# EAGLE design lichtenstein_pwm (EAGLE 9.0.1)

## Sheet 1 of 2: Omega2 socket, power supplies
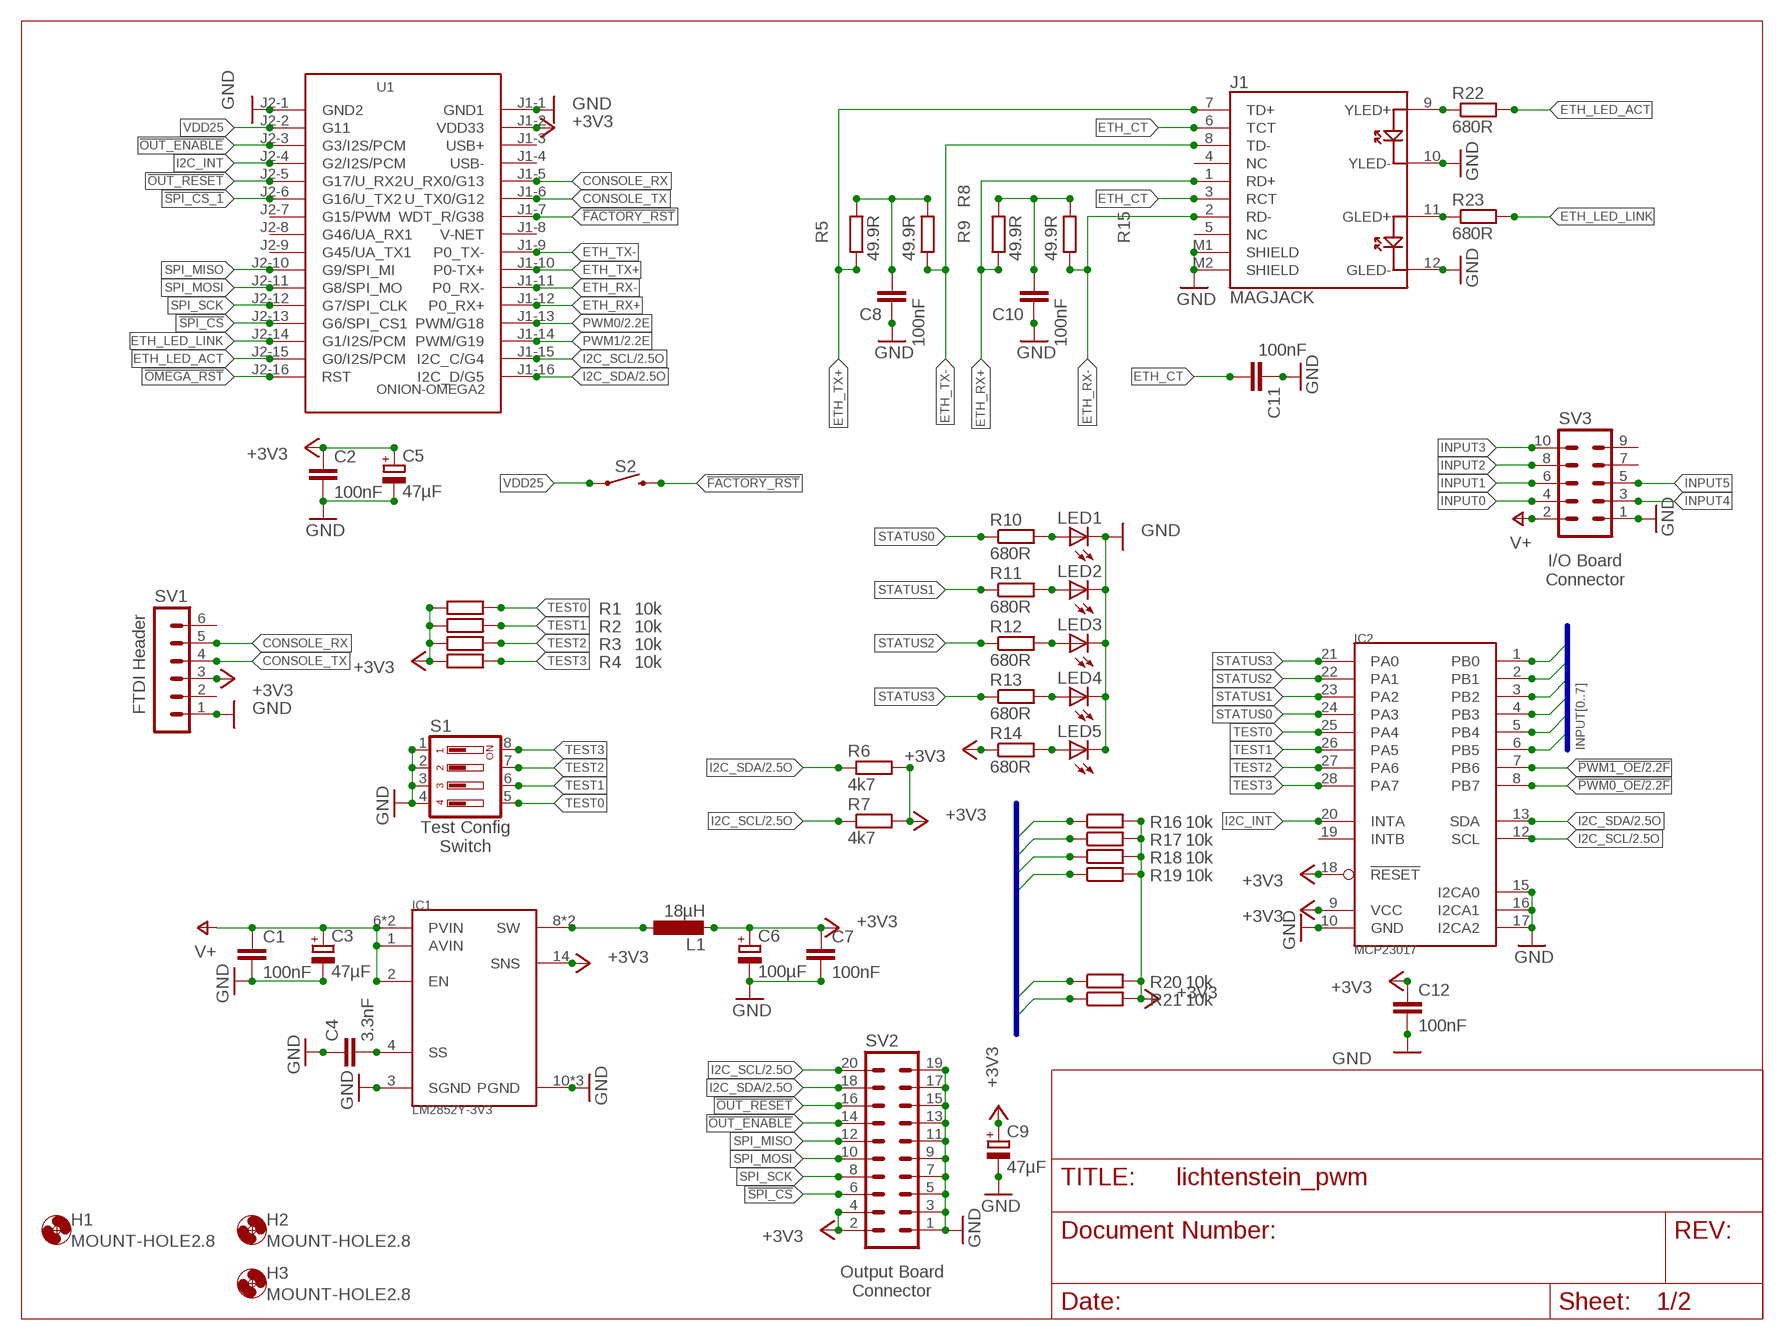
[diagram p0: schematic, sheet 1]

### Parts
C1  100nF  C-EUC0805  [C0805]
C2  100nF  C-EUC0805  [C0805]
C3  47µF  CPOL-EUCT7343  [CT7343]
C4  3.3nF  C-EUC0805  [C0805]
C5  47µF  CPOL-EUCT7343  [CT7343]
C6  100µF  CPOL-EUCT7343  [CT7343]
C7  100nF  C-EUC0805  [C0805]
C8  100nF  C-EUC0805  [C0805]
C9  47µF  CPOL-EUSMCD  [SMC_D]
C10  100nF  C-EUC0805  [C0805]
C11  100nF  C-EUC0805  [C0805]
C12  100nF  C-EUC0805  [C0805]
H1  MOUNT-HOLE2.8  [2,8]
H2  MOUNT-HOLE2.8  [2,8]
H3  MOUNT-HOLE2.8  [2,8]
IC1  LM2852Y-3V3  LM2852HTSSOP14  [HTSSOP14]
IC2  MCP23017  MCP23017SSOP28  [SSOP28]
J1  MAGJACK  [MAGJACK]
L1  18µH  SRR1050A  [SRR1050A]
LED1  LEDCHIPLED_1206  [CHIPLED_1206]
LED2  LEDCHIPLED_1206  [CHIPLED_1206]
LED3  LEDCHIPLED_1206  [CHIPLED_1206]
LED4  LEDCHIPLED_1206  [CHIPLED_1206]
LED5  LEDCHIPLED_1206  [CHIPLED_1206]
R1  10k  R-EU_M0805  [M0805]
R2  10k  R-EU_M0805  [M0805]
R3  10k  R-EU_M0805  [M0805]
R4  10k  R-EU_M0805  [M0805]
R5  49.9R  R-EU_M0805  [M0805]
R6  4k7  R-EU_M0805  [M0805]
R7  4k7  R-EU_M0805  [M0805]
R8  49.9R  R-EU_M0805  [M0805]
R9  49.9R  R-EU_M0805  [M0805]
R10  680R  R-EU_M0805  [M0805]
R11  680R  R-EU_M0805  [M0805]
R12  680R  R-EU_M0805  [M0805]
R13  680R  R-EU_M0805  [M0805]
R14  680R  R-EU_M0805  [M0805]
R15  49.9R  R-EU_M0805  [M0805]
R16  10k  R-EU_M0805  [M0805]
R17  10k  R-EU_M0805  [M0805]
R18  10k  R-EU_M0805  [M0805]
R19  10k  R-EU_M0805  [M0805]
R20  10k  R-EU_M0805  [M0805]
R21  10k  R-EU_M0805  [M0805]
R22  680R  R-EU_M0805  [M0805]
R23  680R  R-EU_M0805  [M0805]
S1  219-04  [CTS-219-04]
S2  MOMENTARY-SWITCH-SPST-PTH-6.0MM  [TACTILE_SWITCH_PTH_6.0MM]
SV1  MA06-1  [MA06-1]
SV2  MA10-2  [MA10-2]
SV3  MA05-2  [MA05-2]
U1  ONION-OMEGA2  [ONION-2MM-2X16]

### Nets
!FACTORY_RST: S2.3 U1.J1-7(WDT_R/G38)
!OMEGA_RST: U1.J2-16(RST)
!OUT_ENABLE: SV2.14 U1.J2-3(G3/I2S/PCM)
!OUT_RESET: SV2.16 U1.J2-5(G17/U_RX2)
!PWM0_OE: IC2.8(PB7) ; also sheet 2
!PWM1_OE: IC2.7(PB6) ; also sheet 2
!SPI_CS: SV2.6 U1.J2-13(G6/SPI_CS1)
!SPI_CS_1: U1.J2-6(G16/U_TX2)
+3V3: C2.1 C5.+ C6.+ C7.1 C9.+ C12.1 IC1.14(SNS) IC2.9(VCC) IC2.18(!RESET) L1.P$2 R1.1 R2.1 R3.1 R4.1 R6.2 R7.2 R14.1 R16.2 R17.2 R18.2 R19.2 R20.2 R21.2 SV1.3 SV2.2 SV2.4 U1.J1-2(VDD33) ; also sheet 2
CONSOLE_RX: SV1.5 U1.J1-5(U_RX0/G13)
CONSOLE_TX: SV1.4 U1.J1-6(U_TX0/G12)
ETH_CT: C11.2 J1.3(RCT) J1.6(TCT)
ETH_LED_ACT: R22.2 U1.J2-15(G0/I2S/PCM)
ETH_LED_LINK: R23.2 U1.J2-14(G1/I2S/PCM)
ETH_RX+: J1.1(RD+) R9.1 U1.J1-12(P0_RX+)
ETH_RX-: J1.2(RD-) R15.1 U1.J1-11(P0_RX-)
ETH_TX+: J1.7(TD+) R5.1 U1.J1-10(P0-TX+)
ETH_TX-: J1.8(TD-) R8.1 U1.J1-9(P0_TX-)
GND: C1.2 C2.2 C3.- C4.1 C5.- C6.- C7.2 C8.1 C9.- C10.1 C11.1 C12.2 IC1.3(SGND) IC1.10(PGND) IC1.11(PGND) IC1.PAD(PGND) IC2.10(GND) IC2.15(I2CA0) IC2.16(I2CA1) IC2.17(I2CA2) J1.10(YLED-) J1.12(GLED-) J1.M1(SHIELD) J1.M2(SHIELD) LED1.C LED2.C LED3.C LED4.C LED5.C S1.1 S1.2 S1.3 S1.4 SV1.1 SV2.1 SV2.3 SV2.5 SV2.7 SV2.9 SV2.11 SV2.13 SV2.15 SV2.17 SV2.19 SV3.1 U1.J1-1(GND1) U1.J2-1(GND2) ; also sheet 2
I2C_INT: IC2.20(INTA) U1.J2-4(G2/I2S/PCM)
I2C_SCL: IC2.12(SCL) R7.1 SV2.20 U1.J1-15(I2C_C/G4) ; also sheet 2
I2C_SDA: IC2.13(SDA) R6.1 SV2.18 U1.J1-16(I2C_D/G5) ; also sheet 2
INPUT0: IC2.2(PB1) R16.1 SV3.4
INPUT1: IC2.4(PB3) R17.1 SV3.6
INPUT2: IC2.6(PB5) R20.1 SV3.8
INPUT3: IC2.5(PB4) R21.1 SV3.10
INPUT4: IC2.1(PB0) R18.1 SV3.3
INPUT5: IC2.3(PB2) R19.1 SV3.5
N$1: LED5.A R14.2
N$2: LED1.A R10.2
N$3: C8.2 R5.2 R8.2
N$4: J1.9(YLED+) R22.1
N$5: J1.11(GLED+) R23.1
N$6: C10.2 R9.2 R15.2
N$7: IC1.8(SW) IC1.9(SW) L1.P$1
N$8: C4.2 IC1.4(SS)
N$9: LED2.A R11.2
N$10: LED3.A R12.2
N$11: LED4.A R13.2
PWM0: U1.J1-13(PWM/G18) ; also sheet 2
PWM1: U1.J1-14(PWM/G19) ; also sheet 2
SPI_MISO: SV2.12 U1.J2-10(G9/SPI_MI)
SPI_MOSI: SV2.10 U1.J2-11(G8/SPI_MO)
SPI_SCK: SV2.8 U1.J2-12(G7/SPI_CLK)
STATUS0: IC2.24(PA3) R10.1
STATUS1: IC2.23(PA2) R11.1
STATUS2: IC2.22(PA1) R12.1
STATUS3: IC2.21(PA0) R13.1
TEST0: IC2.25(PA4) R1.2 S1.5
TEST1: IC2.26(PA5) R2.2 S1.6
TEST2: IC2.27(PA6) R3.2 S1.7
TEST3: IC2.28(PA7) R4.2 S1.8
V+: C1.1 C3.+ IC1.1(AVIN) IC1.2(EN) IC1.6(PVIN) IC1.7(PVIN) SV3.2 ; also sheet 2
VDD25: S2.1 U1.J2-2(G11)
Unconnected: IC2.19(INTB) J1.4(NC) J1.5(NC) SV1.2 SV1.6 SV3.7 SV3.9 U1.J1-3(USB+) U1.J1-4(USB-) U1.J1-8(V-NET) U1.J2-7(G15/PWM) U1.J2-8(G46/UA_RX1) U1.J2-9(G45/UA_TX1)

### Buses
INPUT[0..7]

### Notes on the sheet
- I/O Board
  Connector
- FTDI Header
- Test Config
  Switch
- Output Board
  Connector

## Sheet 2 of 2: Outputs
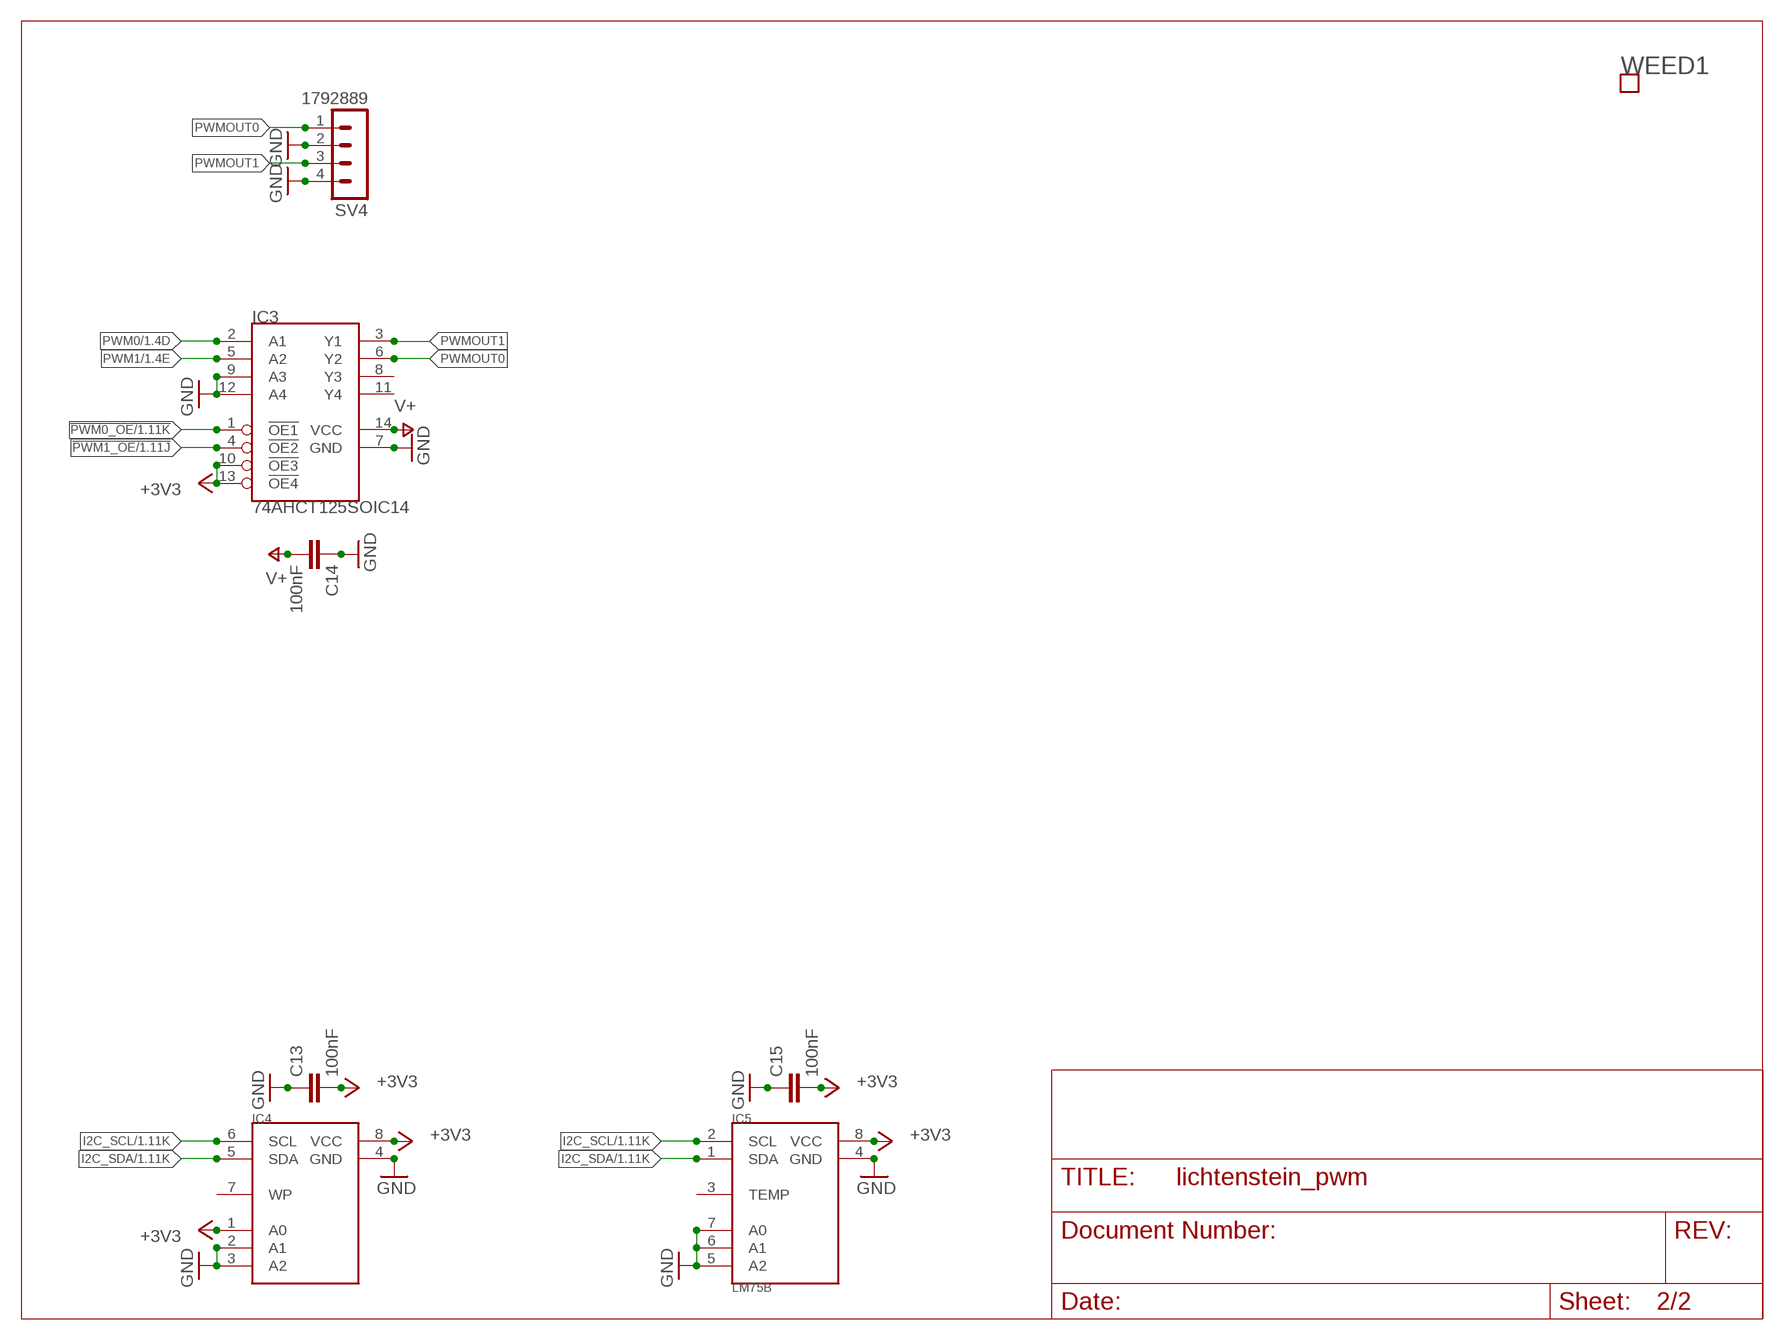
[diagram p1: schematic, sheet 2]

### Parts
C13  100nF  C-EUC0805  [C0805]
C14  100nF  C-EUC0805  [C0805]
C15  100nF  C-EUC0805  [C0805]
IC3  74AHCT125SOIC14  [SO14]
IC4  AT24C02DSOIC-8  [SOIC8]
IC5  LM75B  [SOIC8]
SV4  1792889  [1792889]
WEED1  WEED  [DOINK]

### Nets
!PWM0_OE: IC3.1(!OE1) ; also sheet 1
!PWM1_OE: IC3.4(!OE2) ; also sheet 1
+3V3: C13.2 C15.2 IC3.10(!OE3) IC3.13(!OE4) IC4.1(A0) IC4.8(VCC) IC5.8(VCC) ; also sheet 1
GND: C13.1 C14.1 C15.1 IC3.7(GND) IC3.9(A3) IC3.12(A4) IC4.2(A1) IC4.3(A2) IC4.4(GND) IC5.5(A2) IC5.6(A1) IC5.7(A0) SV4.2 SV4.4 ; also sheet 1
I2C_SCL: IC4.6(SCL) IC5.2(SCL) ; also sheet 1
I2C_SDA: IC4.5(SDA) IC5.1(SDA) ; also sheet 1
PWM0: IC3.2(A1) ; also sheet 1
PWM1: IC3.5(A2) ; also sheet 1
PWMOUT0: IC3.6(Y2) SV4.1
PWMOUT1: IC3.3(Y1) SV4.3
V+: C14.2 IC3.14(VCC) ; also sheet 1
Unconnected: IC3.8(Y3) IC3.11(Y4) IC4.7(WP) IC5.3(TEMP)

## Power pins joined to a net without a drawn wire
GND: IC5.4(GND)

## Library data of the parts
C1 C2 C7 C8 C10-C15 = rcl:C-EU: CAPACITOR, European symbol; MOUSER: 710-885012207072; SPICEPREFIX: C
C3 C5 C9 = rcl:CPOL-EU: POLARIZED CAPACITOR, European symbol; MOUSER: 581-TAJD476M016RNJV; SPICEPREFIX: C
C4 = rcl:C-EU: CAPACITOR, European symbol; MOUSER: 710-885012207089; SPICEPREFIX: C
C6 = rcl:CPOL-EU: POLARIZED CAPACITOR, European symbol; MOUSER: 581-NOSD107M006; SPICEPREFIX: C
H1-H3 = holes:MOUNT-HOLE: MOUNTING HOLE with drill center marker
IC1 = lichtenstein_onion:LM2852: 2A 500/1500kHz Synchronous Buck Regulator Information <http://www.ti.com/product/lm2852/description>; MOUSER: 926-LM2852YMXA33NOPB
IC2 = lichtenstein_onion:MCP23017; MOUSER: 579-MCP23017T-E/SS
IC3 = lichtenstein_onion:74AHCT125: UADRUPLE BUS BUFFER GATES WITH 3-STATE OUTPUTS Datasheet <http://www.ti.com/lit/ds/symlink/sn74ahct125.pdf>; MOUSER: 595-SN74AHCT125D
IC4 = lichtenstein_onion:AT24C02D: I2C-Compatible (2-wire) Serial EEPROM; 1-Kbit (128 x 8) or 2-Kbit (256 x 8) Datasheet <http://ww1.microchip.com/downloads/en/DeviceDoc/Atmel-8871F-SEEPROM-AT24C01D-02D-Datasheet.pdf>; MOUSER: 556-AT24C02D-SSHM-T
IC5 = lichtenstein_onion:LM75B: Digital temperature sensor and thermal watchdog Datasheet <https://www.mouser.com/datasheet/2/302/LM75B-1126491.pdf>; MOUSER: 771-LM75BD118
J1 = SparkFun-Connectors:MAGJACK: MAGJACK: RJ-45 with LEDs This is a single port, RJ45 ethernet jacks with built in transformer (magnetics), status LEDs, and shielding. Here is the connector we sell at SparkFun: RJ45 Ethernet MagJack-Compatible <https://www.sparkfun.com/products/8534> (PRT-08534) Datasheet <http://www.sparkfun.com/datasheets/Prototyping/MagJack.pdf> It is used on this SparkFun product: SparkFun RJ45 MagJack Breakout <https://www.sparkfun.com/products/13021> (BOB-13021); PROD_ID: CONN-09556; SF_ID: PRT-08534
L1 = lichtenstein_onion:SRR1050A: SRR1050A Series - Shielded Power Inductors Datasheet <https://www.mouser.com/datasheet/2/54/rr1050a-964771.pdf>; MOUSER: 652-SRR1050A-180Y
LED1 = led:LED: LED OSRAM: - CHIPLED LG R971, LG N971, LY N971, LG Q971, LY Q971, LO R971, LY R971 LH N974, LH R974 LS Q976, LO Q976, LY Q976 LO Q996 - Hyper CHIPLED LW Q18S LB Q993, LB Q99A, LB R99A - SideLED LS A670, LO A670, LY A670, LG A670, LP A670 LB A673, LV A673, LT A673, LW A673 LH A674 LY A675 LS A676, LA A676, LO A676, LY A676, LW A676 LS A679, LY A679, LG A679 - Hyper Micro SIDELED® LS Y876, LA Y876, LO Y876, LY Y876 LT Y87S - SmartLED LW L88C, LW L88S LB L89C, LB L89S, LG L890 LS L89K, LO L89K, LY L89K LS L896, LA L896, LO L896, LY L896 - TOPLED LS T670, LO T670, LY T670, LG T670, LP T670 LSG T670, LSP T670, LSY T670, LOP T670, LYG T670 LG T671, LOG T671, LSG T671 LB T673, LV T673, LT T673, LW T673 LH T674 LS T676, LA T676, LO T676, LY T676, LB T676, LH T676, LSB T676, LW T676 LB T67C, LV T67C, LT T67C, LS T67K, LO T67K, LY T67K, LW E67C LS E67B, LA E67B, LO E67B, LY E67B, LB E67C, LV E67C, LT E67C LW T67C LS T679, LY T679, LG T679 LS T770, LO T770, LY T770, LG T770, LP T770 LB T773, LV T773, LT T773, LW T773 LH T774 LS E675, LA E675, LY E675, LS T675 LS T776, LA T776, LO T776, LY T776, LB T776 LHGB T686 LT T68C, LB T68C - Hyper Mini TOPLED® LB M676 - Mini TOPLED Santana® LG M470 LS M47K, LO M47K, LY M47K Source: http://www.osram.convergy.de LUXEON: - LUMILED® LXK2-PW12-R00, LXK2-PW12-S00, LXK2-PW14-U00, LXK2-PW14-V00 LXK2-PM12-R00, LXK2-PM12-S00, LXK2-PM14-U00 LXK2-PE12-Q00, LXK2-PE12-R00, LXK2-PE12-S00, LXK2-PE14-T00, LXK2-PE14-U00 LXK2-PB12-K00, LXK2-PB12-L00, LXK2-PB12-M00, LXK2-PB14-N00, LXK2-PB14-P00, LXK2-PB14-Q00 LXK2-PR12-L00, LXK2-PR12-M00, LXK2-PR14-Q00, LXK2-PR14-R00 LXK2-PD12-Q00, LXK2-PD12-R00, LXK2-PD12-S00 LXK2-PH12-R00, LXK2-PH12-S00 LXK2-PL12-P00, LXK2-PL12-Q00, LXK2-PL12-R00 Source: www.luxeon.com KINGBRIGHT: KA-3528ASYC Source: www.kingbright.com; MOUSER: 604-APTR3216SRCPRV
LED2-LED5 = led:LED: LED OSRAM: - CHIPLED LG R971, LG N971, LY N971, LG Q971, LY Q971, LO R971, LY R971 LH N974, LH R974 LS Q976, LO Q976, LY Q976 LO Q996 - Hyper CHIPLED LW Q18S LB Q993, LB Q99A, LB R99A - SideLED LS A670, LO A670, LY A670, LG A670, LP A670 LB A673, LV A673, LT A673, LW A673 LH A674 LY A675 LS A676, LA A676, LO A676, LY A676, LW A676 LS A679, LY A679, LG A679 - Hyper Micro SIDELED® LS Y876, LA Y876, LO Y876, LY Y876 LT Y87S - SmartLED LW L88C, LW L88S LB L89C, LB L89S, LG L890 LS L89K, LO L89K, LY L89K LS L896, LA L896, LO L896, LY L896 - TOPLED LS T670, LO T670, LY T670, LG T670, LP T670 LSG T670, LSP T670, LSY T670, LOP T670, LYG T670 LG T671, LOG T671, LSG T671 LB T673, LV T673, LT T673, LW T673 LH T674 LS T676, LA T676, LO T676, LY T676, LB T676, LH T676, LSB T676, LW T676 LB T67C, LV T67C, LT T67C, LS T67K, LO T67K, LY T67K, LW E67C LS E67B, LA E67B, LO E67B, LY E67B, LB E67C, LV E67C, LT E67C LW T67C LS T679, LY T679, LG T679 LS T770, LO T770, LY T770, LG T770, LP T770 LB T773, LV T773, LT T773, LW T773 LH T774 LS E675, LA E675, LY E675, LS T675 LS T776, LA T776, LO T776, LY T776, LB T776 LHGB T686 LT T68C, LB T68C - Hyper Mini TOPLED® LB M676 - Mini TOPLED Santana® LG M470 LS M47K, LO M47K, LY M47K Source: http://www.osram.convergy.de LUXEON: - LUMILED® LXK2-PW12-R00, LXK2-PW12-S00, LXK2-PW14-U00, LXK2-PW14-V00 LXK2-PM12-R00, LXK2-PM12-S00, LXK2-PM14-U00 LXK2-PE12-Q00, LXK2-PE12-R00, LXK2-PE12-S00, LXK2-PE14-T00, LXK2-PE14-U00 LXK2-PB12-K00, LXK2-PB12-L00, LXK2-PB12-M00, LXK2-PB14-N00, LXK2-PB14-P00, LXK2-PB14-Q00 LXK2-PR12-L00, LXK2-PR12-M00, LXK2-PR14-Q00, LXK2-PR14-R00 LXK2-PD12-Q00, LXK2-PD12-R00, LXK2-PD12-S00 LXK2-PH12-R00, LXK2-PH12-S00 LXK2-PL12-P00, LXK2-PL12-Q00, LXK2-PL12-R00 Source: www.luxeon.com KINGBRIGHT: KA-3528ASYC Source: www.kingbright.com; MOUSER: 604-APTR3216SGC
R1-R4 R16-R21 = rcl:R-EU_: RESISTOR, European symbol; MOUSER: 652-CR0805FX-1002ELF; SPICEPREFIX: R
R5 R9 R15 = rcl:R-EU_: RESISTOR, European symbol; MOUSER: 652-CR0805FX-49R9ELF; SPICEPREFIX: R
R6-R8 = rcl:R-EU_: RESISTOR, European symbol; MOUSER: 652-CR0805-FX4701GLF; SPICEPREFIX: R
R10-R14 R22 R23 = rcl:R-EU_: RESISTOR, European symbol; MOUSER: 652-CR0805-FX6800GLF; SPICEPREFIX: R
S1 = switch-dil:219-04*: Surface Mount DIP Switch Series 219 SMT CTS Electronic Components Sourc: www.ctscorp.com; MOUSER: 774-219-4LPS; OC_FARNELL: unknown; OC_NEWARK: unknown
S2 = SparkFun-Switches:MOMENTARY-SWITCH-SPST: Momentary Switch (Pushbutton) - SPST Normally-open (NO) SPST momentary switches (buttons, pushbuttons). Variants PTH-12MM - 12mm square, through-hole Momentary Pushbutton Switch - 12mm Square <https://www.sparkfun.com/products/9190> (COM-09190) PTH-6.0MM, PTH-6.0MM-KIT - 6.0mm square, through-hole Mini Pushbutton Switch <https://www.sparkfun.com/products/97> (COM-00097) KIT package intended for soldering kit's - only one side of pads' copper is exposed. PTH-RIGHT-ANGLE-KIT - Right-angle, through-hole Right Angle Tactile Button <https://www.sparkfun.com/products/10791> - Used on SparkFun BigTime Watch Kit <https://www.sparkfun.com/products/11734> SMD-12MM - 12mm square, surface-mount Tactile Button - SMD (12mm) <https://www.sparkfun.com/products/12993> (COM-12993) Used on SparkFun PicoBoard <https://www.sparkfun.com/products/11888> SMD-4.5MM - 4.5mm Square Trackball Switch Used on SparkFun Blackberry Trackballer Breakout <https://www.sparkfun.com/products/13169> SMD-4.6MMX2.8MM - 4.60mm x 2.80mm, surface mount Used on SparkFun SAMD21 Mini Breakout <https://www.sparkfun.com/products/13664> SMD-5.2MM, SMD-5.2-REDUNDANT - 5.2mm square, surface-mount Mini Pushbutton Switch - SMD <https://www.sparkfun.com/products/8720> (COM-08720) Used on Arduino Pro Mini <https://www.sparkfun.com/products/11114> REDUNDANT package connects both switch circuits together SMD-6.0X3.5MM - 6.0 x 3.5mm, surface mount Momentary Reset Switch SMD <https://www.sparkfun.com/products/8229> (COM-08229) SMD-6.2MM-TALL - 6.2mm square, surface mount Tactile Button - SMD (6mm) <https://www.sparkfun.com/products/12992> Used on SparkFun Digital Sandbox <https://www.sparkfun.com/products/12651> SMD-RIGHT-ANGLE - Right-angle, surface mount Used on SparkFun Block for Intel® Edison - Arduino <https://www.sparkfun.com/products/13036>; MOUSER: 612-TL1105B; PROD_ID: SWCH-08441; SF_SKU: COM-00097
SV1 = con-lstb:MA06-1: PIN HEADER; OC_FARNELL: unknown; OC_NEWARK: unknown
SV2 = con-lstb:MA10-2: PIN HEADER; MOUSER: 517-30320-6002; OC_FARNELL: unknown; OC_NEWARK: unknown
SV3 = con-lstb:MA05-2: PIN HEADER; MOUSER: 517-30310-6002; OC_FARNELL: unknown; OC_NEWARK: unknown
SV4 = lichtenstein_onion:1792889; MOUSER: 651-1792889
U1 = lichtenstein_onion:ONION-OMEGA2: Onion Omega; MOUSER: 353-OM-O2P
WEED1 = lichtenstein_onion:WEED

## Board
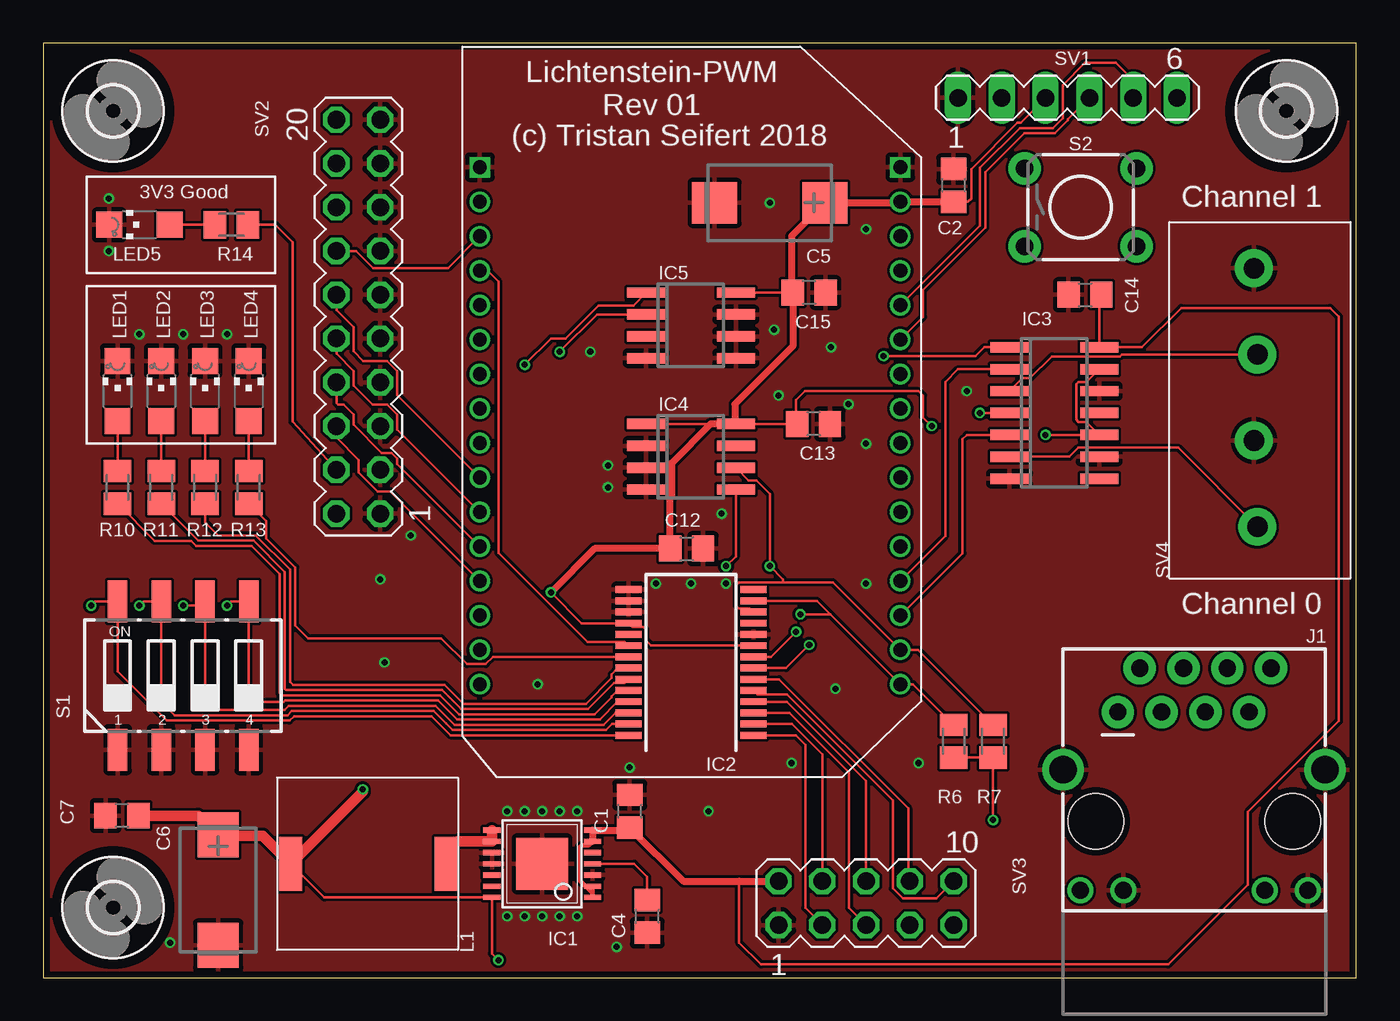
[diagram p2: board, top side]
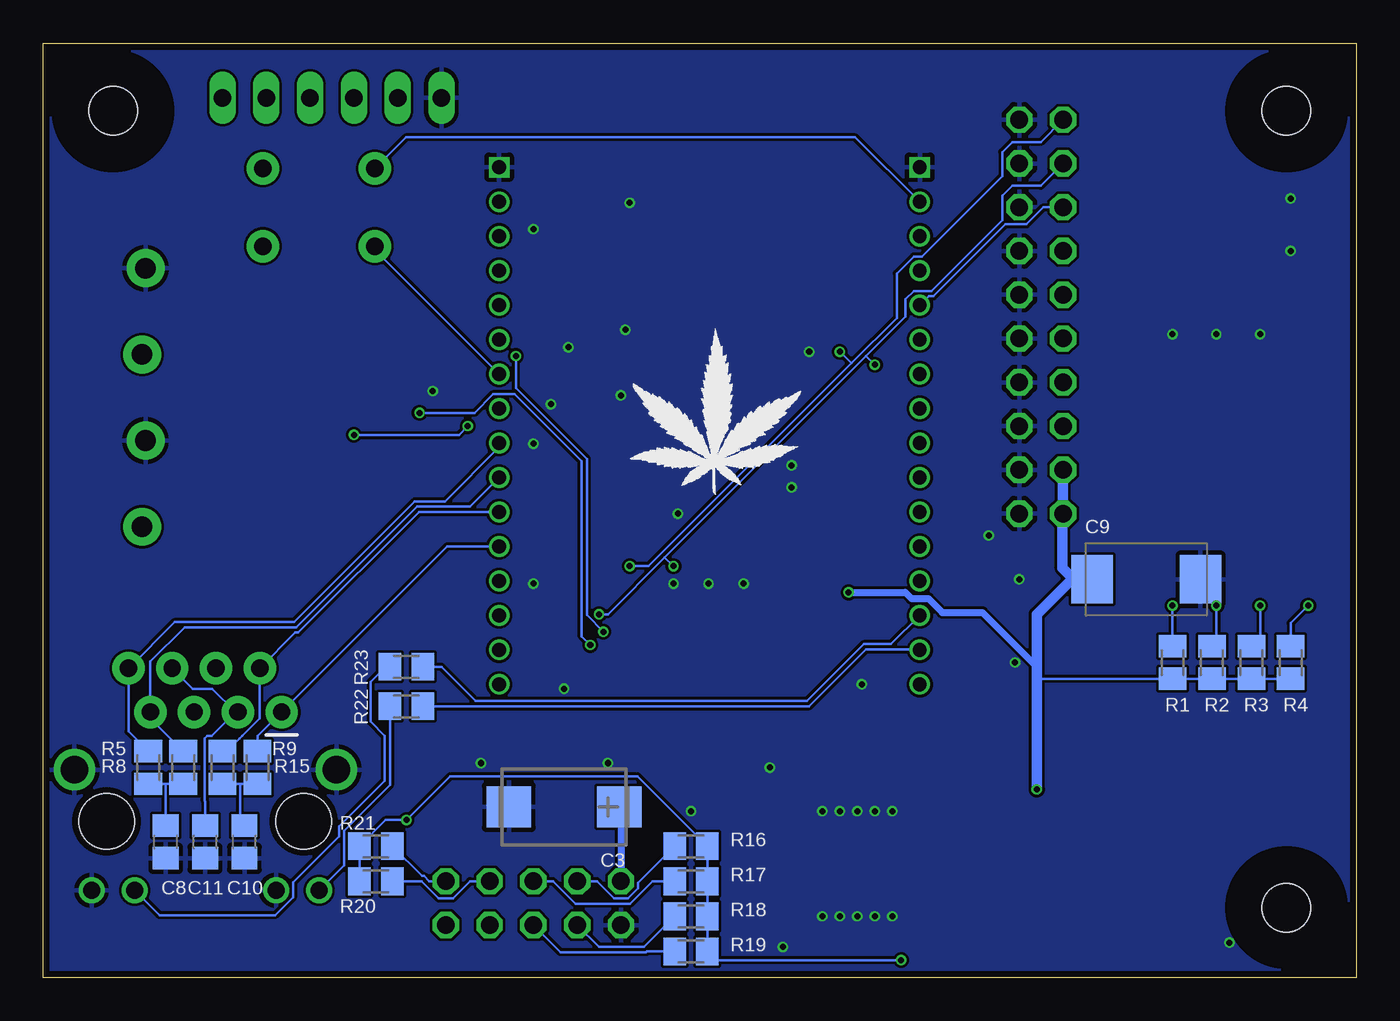
[diagram p3: board, bottom side, seen from below]

Size 76.2 x 54.23 mm. Coordinates in mm from the lower left corner, seen from the top.
Outline: 0,0 76.2,0 76.2,54.23 0,54.23 0,0
Copper layers (1*16): Top 0.035559375mm / dielectric 1.6mm / Bottom 0.035559375mm
Design rules "oshpark-2layer": minimum track width 6mil, minimum drill 10mil, track to track 6mil, track to pad 6mil, pad to pad 6mil, via to via 6mil, smd to smd 6mil, copper to edge 15mil, drill to drill 6mil, minimum pad ring 5mil, minimum via ring 5mil, stop-mask expansion 2.5mil, vias tented up to drill 0mil, thermal gap 10mil

### Footprints (pad centres in the part's own frame; a part is rotated, then mirrored left to right if it is on the bottom)
C0805 = smd 1.3 x 1.5: 1 -0.95,0; 2 0.95,0
CT7343 = smd 2.6 x 2.4: + -3.2,0; - 3.2,0
SMC_D = smd 2.4 x 2.8: + -3.15,0; - 3.15,0
2,8 = hole 2.8: 0,0
HTSSOP14 = smd 0.305 x 0.991: 1 -1.95,-2.918; 2 -1.3,-2.918; 3 -0.65,-2.918; 4 0,-2.918; 5 0.65,-2.918; 6 1.3,-2.918; 7 1.95,-2.918; 8 1.95,2.918; 9 1.3,2.918; 10 0.65,2.918; 11 0,2.918; 12 -0.65,2.918; 13 -1.3,2.918; 14 -1.95,2.918 | smd 3 x 3: PAD 0,0
SSOP28 = smd 0.4 x 1.5: 1 -4.225,-3.625; 2 -3.575,-3.625; 3 -2.925,-3.625; 4 -2.275,-3.625; 5 -1.625,-3.625; 6 -0.975,-3.625; 7 -0.325,-3.625; 8 0.325,-3.625; 9 0.975,-3.625; 10 1.625,-3.625; 11 2.275,-3.625; 12 2.925,-3.625; 13 3.575,-3.625; 14 4.225,-3.625; 15 4.225,3.625; 16 3.575,3.625; 17 2.925,3.625; 18 2.275,3.625; 19 1.625,3.625; 20 0.975,3.625; 21 0.325,3.625; 22 -0.325,3.625; 23 -0.975,3.625; 24 -1.625,3.625; 25 -2.275,3.625; 26 -2.925,3.625; 27 -3.575,3.625; 28 -4.225,3.625
SO14 = smd 0.6 x 2.2: 1 -3.81,-2.6; 2 -2.54,-2.6; 3 -1.27,-2.6; 4 0,-2.6; 5 1.27,-2.6; 6 2.54,-2.6; 7 3.81,-2.6; 8 3.81,2.6; 9 2.54,2.6; 10 1.27,2.6; 11 0,2.6; 12 -1.27,2.6; 13 -2.54,2.6; 14 -3.81,2.6
SOIC8 = smd 0.6 x 2.2: 1 -1.905,-2.6; 2 -0.635,-2.6; 3 0.635,-2.6; 4 1.905,-2.6; 5 1.905,2.6; 6 0.635,2.6; 7 -0.635,2.6; 8 -1.905,2.6
MAGJACK = drill 1 pad 1.88: 1 3.175,17.445; 2 4.445,19.985; 3 5.715,17.445; 4 6.985,19.985; 5 8.255,17.445; 6 9.525,19.985; 7 10.795,17.445; 8 12.065,19.985 | drill 1 pad 1.27: 9 1,7.1; 10 3.5,7.1; 11 11.7,7.1; 12 14.2,7.1 | drill 1.6 pad 2.184: M1 0,14.1; M2 15.2,14.1 | hole 3.2: 1.905,11.095; 13.335,11.095
SRR1050A = smd 3.15 x 1.325: P$1 0,0; P$2 0,-9
CHIPLED_1206 = smd 1.5 x 1.5: A 0,-1.75; C 0,1.75
M0805 = smd 1.3 x 1.6: 1 -0.95,0; 2 0.95,0
CTS-219-04 = smd 1.13 x 2.44: 1 -3.81,-4.3; 2 -1.27,-4.3; 3 1.27,-4.3; 4 3.81,-4.3; 5 3.81,4.3; 6 1.27,4.3; 7 -1.27,4.3; 8 -3.81,4.3
TACTILE_SWITCH_PTH_6.0MM = drill 1.016 pad 1.88: 1 -3.251,2.261; 2 3.251,2.261; 3 -3.251,-2.261; 4 3.251,-2.261
MA06-1 = drill 1.016 long: 1 -6.35,0; 2 -3.81,0; 3 -1.27,0; 4 1.27,0; 5 3.81,0; 6 6.35,0
MA10-2 = drill 1.016 octagon: 1 -11.43,-1.27; 2 -11.43,1.27; 3 -8.89,-1.27; 4 -8.89,1.27; 5 -6.35,-1.27; 6 -6.35,1.27; 7 -3.81,-1.27; 8 -3.81,1.27; 9 -1.27,-1.27; 10 -1.27,1.27; 11 1.27,-1.27; 12 1.27,1.27; 13 3.81,-1.27; 14 3.81,1.27; 15 6.35,-1.27; 16 6.35,1.27; 17 8.89,-1.27; 18 8.89,1.27; 19 11.43,-1.27; 20 11.43,1.27
MA05-2 = drill 1.016 octagon: 1 -5.08,-1.27; 2 -5.08,1.27; 3 -2.54,-1.27; 4 -2.54,1.27; 5 0,-1.27; 6 0,1.27; 7 2.54,-1.27; 8 2.54,1.27; 9 5.08,-1.27; 10 5.08,1.27
1792889 = drill 1.2 pad 2.2: 1 -7.62,-0.1; 2 -2.62,0.1; 3 2.38,-0.1; 4 7.38,0.1
ONION-2MM-2X16 = drill 0.8 square: J1-1 12.4,14; J2-1 -12,14 | drill 0.8: J1-2 12.4,12; J1-3 12.4,10; J1-4 12.4,8; J1-5 12.4,6; J1-6 12.4,4; J1-7 12.4,2; J1-8 12.4,0; J1-9 12.4,-2; J1-10 12.4,-4; J1-11 12.4,-6; J1-12 12.4,-8; J1-13 12.4,-10; J1-14 12.4,-12; J1-15 12.4,-14; J1-16 12.4,-16; J2-2 -12,12; J2-3 -12,10; J2-4 -12,8; J2-5 -12,6; J2-6 -12,4; J2-7 -12,2; J2-8 -12,0; J2-9 -12,-2; J2-10 -12,-4; J2-11 -12,-6; J2-12 -12,-8; J2-13 -12,-10; J2-14 -12,-12; J2-15 -12,-14; J2-16 -12,-16

### Placement (x,y rotation side)
C1  34.04,9.65 90 top
C2  52.83,45.97 90 top
C3  45.97,9.91 180 bottom
C4  35.05,3.56 90 top
C5  42.16,44.96 180 top
C6  10.16,5.08 270 top
C7  4.57,9.4 180 top
C8  69.09,7.87 90 bottom
C9  12.19,23.11 0 bottom
C10  64.52,7.87 90 bottom
C11  66.8,7.87 90 bottom
C12  37.34,24.89 0 top
C13  44.7,32.13 180 top
C14  60.45,39.62 0 top
C15  44.45,39.75 180 top
H1  4.06,4.06 0 top
H2  4.06,50.29 0 top
H3  72.14,50.29 0 top
IC1  28.96,6.6 90 top
IC2  37.59,18.29 90 top
IC3  58.67,32.77 270 top
IC4  37.59,30.23 270 top
IC5  37.59,37.85 270 top
J1  59.18,-2.03 0 top
L1  23.37,6.6 270 top
LED1  4.32,34.04 0 top
LED2  6.86,34.04 0 top
LED3  9.4,34.04 0 top
LED4  11.94,34.04 0 top
LED5  5.59,43.69 90 top
R1  10.67,18.29 90 bottom
R2  8.38,18.29 90 bottom
R3  6.1,18.29 90 bottom
R4  3.81,18.29 90 bottom
R5  68.07,12.19 270 bottom
R6  52.83,13.72 270 top
R7  55.12,13.72 270 top
R8  70.1,12.19 270 bottom
R9  63.75,12.19 270 bottom
R10  4.32,28.45 90 top
R11  6.86,28.45 90 top
R12  9.4,28.45 90 top
R13  11.94,28.45 90 top
R14  10.92,43.69 180 top
R15  65.79,12.19 270 bottom
R16  38.61,7.62 0 bottom
R17  38.61,5.59 0 bottom
R18  38.61,3.56 0 bottom
R19  38.61,1.52 0 bottom
R20  56.9,5.59 180 bottom
R21  56.9,7.62 180 bottom
R22  55.12,15.75 0 bottom
R23  55.12,18.03 0 bottom
S1  8.13,17.53 0 top
S2  60.2,44.7 0 top
SV1  59.44,51.05 0 top
SV2  18.29,38.35 90 top
SV3  47.75,4.32 0 top
SV4  70.36,33.78 90 top
U1  37.34,33.02 0 top
WEED1  42.16,27.94 0 bottom

### Tracks (layer width: path | path; a pad name or v marks a point on that pad's centre or on a via)
!FACTORY_RST
  Bottom 0.152: U1.J1-7 56.95,42.23 S2.3
!OUT_ENABLE
  Top 0.152: SV2.14 18.16,42.16 19.15,41.17 23.49,41.17 U1.J2-3
!OUT_RESET
  Bottom 0.152: U1.J2-5 24.81,39.54 24.54,39.54 20.37,43.71 19.15,43.71 18.16,44.7 SV2.16
!PWM0_OE  (via drill 0.35)
  Top 0.152: IC2.8 42.23,18.61 v43.69,20.07 | IC3.1 54.61,36.58 54.1,36.07 v48.77,36.07
  Bottom 0.152: v43.69,20.07 44.65,21.03 44.65,30.1 48.77,34.21 v48.77,36.07
!PWM1_OE  (via drill 0.35)
  Top 0.152: v54.36,32.77 IC3.4 | IC2.7 43.11,17.96 v44.45,19.3
  Bottom 0.152: v44.45,19.3 44.96,19.81 44.96,29.97 48.84,33.85 50.08,33.85 51.16,32.77 v54.36,32.77
!SPI_CS
  Top 0.152: SV2.6 17.02,31.34 18.31,30.05 18.31,29.31 19.4,28.22 20.14,28.22 U1.J2-13
+3V3  (via drill 0.35)
  Top 0.152: 49.68,44.96 U1.J1-2 49.78,44.96 | SV2.4 14.48,32.26 14.48,42.67 13.46,43.69 R14.1 | IC2.9 35.27,19.26 34.95,19.58 34.95,20.21 34.81,20.34 34.19,20.34 IC2.18 31.25,20.56 v29.46,22.35 | R6.2 R7.2 v55.12,9.14 | v26.42,1.02 26.04,1.39 IC1.14 16.32,4.65 L1.P$2 | 10.21,8.23 C6.+ | 53.08,45.02 C2.1 | IC4.8 43.43,32.13 | 43.43,32.13 C13.2 | IC4.1 39.37,32.13 | IC3.13 60.53,34.56 60.08,34.56 59.95,34.43 59.95,32.37 60.08,32.24 60.53,32.24 IC3.10 v58.17,31.5 | v51.56,32 51.05,32.51 51.05,33.78 50.8,34.04 44.2,34.04 43.69,33.53 43.69,32.38 43.43,32.13 | SV1.3 56.72,49.61 56.54,49.61 53.85,46.91 53.85,45.21 53.66,45.02 52.58,45.02 | IC5.8 43.43,39.75 C15.2
  Top 0.254: 18.54,10.78 v18.54,10.92
  Top 0.406: C5.+ 49.68,44.96 | U1.J1-2 52.58,45.02 53.08,45.02 | v29.46,22.35 32,24.89 C12.1 36.39,27.81 36.45,27.87 36.45,29.84 38.73,32.13 39.37,32.13 IC4.8 40.13,32.19 40.13,33.27 43.5,36.64 C15.2 | 45.36,44.86 C5.+ | C5.+ 43.43,43.03 43.43,39.75
  Top 0.61: 18.54,10.78 L1.P$2 12.74,8.23 10.21,8.23 | C7.1 8.99,9.4 C6.+
  Bottom 0.152: 18.5,16.73 18.54,16.76 | R4.1 R3.1 R2.1 R1.1 18.48,17.34 18.54,17.27 | R20.2 R21.2 56.32,9.14 v55.12,9.14 52.58,11.68 41.72,11.68 R16.2 R17.2 R18.2 R19.2 37.15,1.02 v26.42,1.02 | v58.17,31.5 52.07,31.5 v51.56,32
  Bottom 0.254: 17.06,27.14 SV2.2
  Bottom 0.406: v29.46,22.35 26.17,22.35 25.8,21.99 24.83,21.99 24.02,21.18 21.69,21.18 18.54,18.03 | C9.+ 16.46,23.16
  Bottom 0.61: SV2.2 SV2.4 | 17.06,27.14 17.06,23.76 16.46,23.16 18.54,21.08 18.54,18.03 18.54,17.27 18.54,16.76 v18.54,10.92
CONSOLE_RX
  Top 0.152: U1.J1-5 54.36,43.64 54.36,46.99 56.67,49.3 58.58,49.3 59.16,49.88 59.16,51.79 60.45,53.09 62.23,53.09 63.25,52.07 SV1.5
CONSOLE_TX
  Top 0.152: U1.J1-6 51.05,38.34 51.05,39.91 54.66,43.51 54.66,46.74 56.92,49 58.7,49 59.46,49.76 59.46,49.81 SV1.4
ETH_CT
  Bottom 0.152: C11.2 66.8,10.23 66.81,10.24 66.81,13.89 66.68,14.02 66.43,14.02 65.03,15.41 | 65.03,15.41 J1.3 | J1.6 67.52,16.76 66.39,16.76 65.03,15.41
ETH_LED_ACT
  Bottom 0.152: R22.2 31.75,15.75 28.45,19.05 25.37,19.05 U1.J2-15
ETH_LED_LINK
  Bottom 0.152: U1.J2-14 27,19.36 28.57,19.36 31.88,16.05 51.1,16.05 53.09,18.03 R23.2
ETH_RX+
  Bottom 0.152: R9.1 63.75,14.02 J1.1 52.75,25.02 U1.J1-12
ETH_RX-
  Bottom 0.152: R15.1 65.52,13.14 64.78,13.88 64.78,13.89 64.65,14.02 64.64,14.02 63.63,15.03 J1.2 61.56,20.02 61.39,20.02 54.39,27.02 U1.J1-11
ETH_TX+
  Bottom 0.152: R5.1 69.98,15.05 J1.7 69.98,18.34 67.99,20.32 61.52,20.32 54.51,27.32 51.43,27.32 U1.J1-10
ETH_TX-
  Bottom 0.152: R8.1 71.25,14.29 J1.8 68.58,20.62 61.64,20.62 54.64,27.63 52.89,27.63 49.74,30.78 U1.J1-9
GND  (via drill 0.35)
  other vias: 33.27,1.78 34.04,12.19 7.37,2.03 8.13,37.34 5.59,37.34 10.67,37.34 3.81,45.21 3.81,42.16 42.16,44.96 39.37,26.92 37.59,22.86 35.56,22.86 39.62,22.86 28.7,17.02 19.81,18.29 43.43,12.45 45.97,16.76 26.92,9.65 30.99,9.65 28.96,9.65 27.94,9.65 29.97,9.65 28.96,3.56 26.92,3.56 30.99,3.56 29.97,3.56 27.94,3.56 21.34,25.65 19.56,23.11 50.8,12.45 38.61,9.65 45.72,36.58 47.75,43.43 42.67,33.78 47.75,30.99 46.74,33.27 32.77,28.45 32.77,29.72 42.42,37.59 31.75,36.32 53.59,34.04 47.75,22.86
  pour Top: 0,54.23 0,0 76.2,0 76.2,54.23
  pour Bottom: 0,54.23 0,0 76.2,0 76.2,54.23
I2C_INT
  Top 0.152: IC2.20 33.75,19.48 31.58,19.48 26.42,24.65 26.42,40.39 25.78,41.02 U1.J2-4
I2C_SCL  (via drill 0.35)
  Top 0.152: R7.1 50.76,19.02 U1.J1-15 45.82,22.94 42.93,22.94 | IC2.12 41,21.43 40.37,21.43 40.24,21.57 40.24,22.81 40.37,22.94 42.93,22.94 | 42.93,22.94 42.93,23.11 v42.16,23.88 42.16,28.07 41.39,28.85 40.93,28.85 IC4.6 | IC5.2 32.13,38.48 v29.97,36.32
  Bottom 0.152: SV2.20 18.31,48.49 19.97,48.49 20.55,47.91 20.55,46.51 25.21,41.85 25.68,41.85 26.67,40.86 26.67,38.28 29.3,35.65 | v42.16,23.88 41.07,23.88 29.3,35.65 | v29.97,36.32 29.3,35.65
I2C_SDA  (via drill 0.35)
  Top 0.152: R6.1 50.48,17.02 U1.J1-16 45.68,21.08 | 45.68,21.08 44.9,21.86 IC2.13 | v43.94,21.08 45.68,21.08 | IC4.5 40.19,24.44 v39.62,23.88 | IC5.1 34.25,39.01 32.23,39.01 30.3,37.08 29.46,37.08 v27.94,35.56
  Bottom 0.152: v43.94,21.08 43.43,21.08 40.13,24.38 | SV2.18 18.31,45.95 19.97,45.95 20.55,45.37 20.55,43.97 24.67,39.85 25.68,39.85 26.17,39.36 26.17,38.35 28.45,36.07 | 28.45,36.07 40.13,24.38 | v39.62,23.88 40.13,24.38 | v27.94,35.56 28.45,36.07
INPUT0
  Top 0.152: IC2.2 43.45,14.71 45.21,12.95 SV3.4
  Bottom 0.152: SV3.4 44.07,5.59 43.08,4.6 42.26,4.6 41.68,5.18 41.68,5.5 R16.1
INPUT1
  Top 0.152: IC2.4 43.16,16 47.75,11.41 SV3.6
  Bottom 0.152: SV3.6 46.61,5.59 45.32,4.29 42.13,4.29 40.84,5.59 R17.1
INPUT2
  Top 0.152: IC2.6 42.71,17.31 50.2,9.82 50.2,5.68 SV3.8
  Bottom 0.152: R20.1 54.23,5.59 53.24,4.6 52.42,4.6 51.43,5.59 SV3.8
INPUT3
  Top 0.152: IC2.5 41.44,16.44 43.15,16.44 49.3,10.29 49.3,5.18 49.88,4.6 51.84,4.6 SV3.10
  Bottom 0.152: R21.1 54.22,5.89 54.11,5.89 53.8,5.59 SV3.10
INPUT4
  Top 0.152: IC2.1 43.67,14.06 44.22,13.51 44.22,4.04 SV3.3
  Bottom 0.152: R18.1 41.34,1.78 43.94,1.78 SV3.3
INPUT5
  Top 0.152: IC2.3 43.31,15.36 46.76,11.91 46.76,4.04 SV3.5
  Bottom 0.152: R19.1 41.16,1.52 41.21,1.47 46.18,1.47 SV3.5
N$1
  Top 0.152: LED5.A R14.2
N$2
  Top 0.152: LED1.A R10.2
N$3
  Bottom 0.152: R5.2 69.09,11.24 | 69.09,11.24 R8.2 | C8.2 69.09,11.24
N$4
  Bottom 0.152: J1.9 58.73,6.53 58.73,8.52 56.07,11.17 R22.1
N$5
  Bottom 0.152: J1.11 69.44,3.63 62.74,3.63 61.7,4.66 61.7,5.54 59.03,8.21 59.03,8.79 56.39,11.43 56.39,14.04 57.2,14.85 57.2,17.16 56.32,18.03 R23.1
N$6
  Bottom 0.152: 64.77,9.33 C10.2 64.77,9.08 64.77,11.24 | R9.2 64.77,11.24 | 64.77,11.24 R15.2
N$7
  Top 0.254: 23.72,7.62 23.71,7.55 23.62,7.11 23.37,6.86 L1.P$1
  Top 0.508: 24.06,7.9 23.71,7.55
  Top 0.61: IC1.8 IC1.9 24.06,7.9
N$8
  Top 0.152: C4.2 35.05,5.84 34.29,6.6 IC1.4
N$9
  Top 0.152: LED2.A R11.2
N$10
  Top 0.152: LED3.A R12.2
N$11
  Top 0.152: LED4.A R13.2
PWM0
  Top 0.152: IC3.2 53.09,35.31 52.35,34.57 52.35,25.63 U1.J1-13
PWM1
  Top 0.152: U1.J1-14 53.34,24.62 53.34,31.24 53.59,31.5 IC3.5
PWMOUT0
  Top 0.152: IC3.6 59.55,30.23 60.08,30.75 65.86,30.75 SV4.1
PWMOUT1
  Top 0.152: IC3.3 56.81,34.78 57.27,34.78 58.54,36.05 62.47,36.05 62.58,36.16 SV4.3
SPI_MISO
  Top 0.152: U1.J2-10 20.55,33.81 20.55,35.21 19.97,35.79 18.57,35.79 18.01,36.35 18.01,37.75 17.02,38.74 SV2.12
SPI_MOSI
  Top 0.152: U1.J2-11 20.55,31.81 20.55,32.67 19.97,33.25 19.11,33.25 18.01,34.35 18.01,35.21 17.02,36.2 SV2.10
SPI_SCK
  Top 0.152: SV2.8 17.02,33.34 17.11,33.25 17.43,33.25 18.01,32.67 18.01,32.09 19.65,30.45 20.22,30.45 20.55,30.13 20.55,29.81 U1.J2-12
STATUS0
  Top 0.152: IC2.24 33.34,16.66 32.99,16.31 32.99,16.27 32,15.28 24.14,15.28 23.04,16.38 13.84,16.38 13.72,16.51 13.72,23.43 12.09,25.05 8.87,25.05 8.58,25.34 6.47,25.34 R10.1
STATUS1
  Top 0.152: R11.1 9,25.36 12.19,25.36 12.22,25.36 14.02,23.55 14.02,16.76 14.1,16.69 23.16,16.69 24.26,15.59 31.62,15.59 33.12,17.09 33.75,17.09 IC2.23
STATUS2
  Top 0.152: IC2.22 33.34,17.96 32.99,17.61 32.99,17.39 31.49,15.89 24.39,15.89 23.29,16.99 14.5,16.99 14.33,17.17 14.33,23.68 12.34,25.66 10.15,25.66 9.4,26.42 R12.1
STATUS3
  Top 0.152: IC2.21 26.1,18.61 25.68,18.19 24.6,18.19 23.1,19.68 15.37,19.68 14.63,20.42 14.63,23.8 12.95,25.48 12.95,26.48 R13.1
TEST0  (via drill 0.35)
  Top 0.152: IC2.25 33.34,16.01 32.31,14.98 24.01,14.98 22.91,16.08 14.05,16.08 13.97,16 12.45,16 11.94,16.51 S1.5 10.9,21.83 v10.67,21.59
  Bottom 0.152: v10.67,21.59 R1.2
TEST1  (via drill 0.35)
  Top 0.152: 9.4,21.59 9.4,16 9.87,15.53 14,15.53 14.25,15.77 22.78,15.77 23.88,14.67 32.53,14.67 33.22,15.36 IC2.26 | 9.4,21.59 S1.6 | v8.13,21.59 9.4,21.59
  Bottom 0.152: v8.13,21.59 8.13,19.49 R2.2
TEST2  (via drill 0.35)
  Top 0.152: IC2.27 33,14.71 32.66,14.37 23.76,14.37 23.38,14.74 22.66,15.47 14.43,15.47 14.18,15.22 7.64,15.22 6.86,16 S1.7 5.82,21.83 v5.59,21.59
  Bottom 0.152: R3.2 5.59,19.75 v5.59,21.59
TEST3  (via drill 0.35)
  Top 0.152: IC2.28 23.63,14.06 22.53,15.16 14.55,15.16 14.3,14.92 7.18,14.92 4.32,17.78 S1.8 3.03,21.83 v2.79,21.59
  Bottom 0.152: v2.79,21.59 3.81,20.57 R4.2
V+
  Top 0.152: C14.2 61.27,39.5 IC3.14 63.75,36.58 66.04,38.86 74.68,38.86 75.18,38.35 75.18,14.89 69.9,9.61 69.9,5.39 65.28,0.76 41.66,0.76 40.39,2.03 40.39,5.59
  Top 0.254: 31.89,8.57 IC1.7 | IC1.2 IC1.1 31.87,4.91 31.1,5.69 31.1,7.52 31.26,7.69 31.66,7.69 IC1.6 | 34.14,8.6 C1.1 33.89,8.55
  Top 0.406: IC1.6 IC1.7 33.89,8.55 | C1.1 37.15,5.59 40.39,5.59 SV3.2
  Bottom 0.406: C3.+ 42.67,9.8 SV3.2
VDD25
  Bottom 0.152: U1.J2-2 29.09,48.77 55.14,48.77 S2.1

### Text on the board
tNames: Lichtenstein-PWM / Rev 01 | (c) Tristan Seifert 2018 | 3V3 Good | Channel 1 | Channel 0